# EAGLE schematic Main_board (EAGLE 6.5.0)

## Sheet 1 of 2
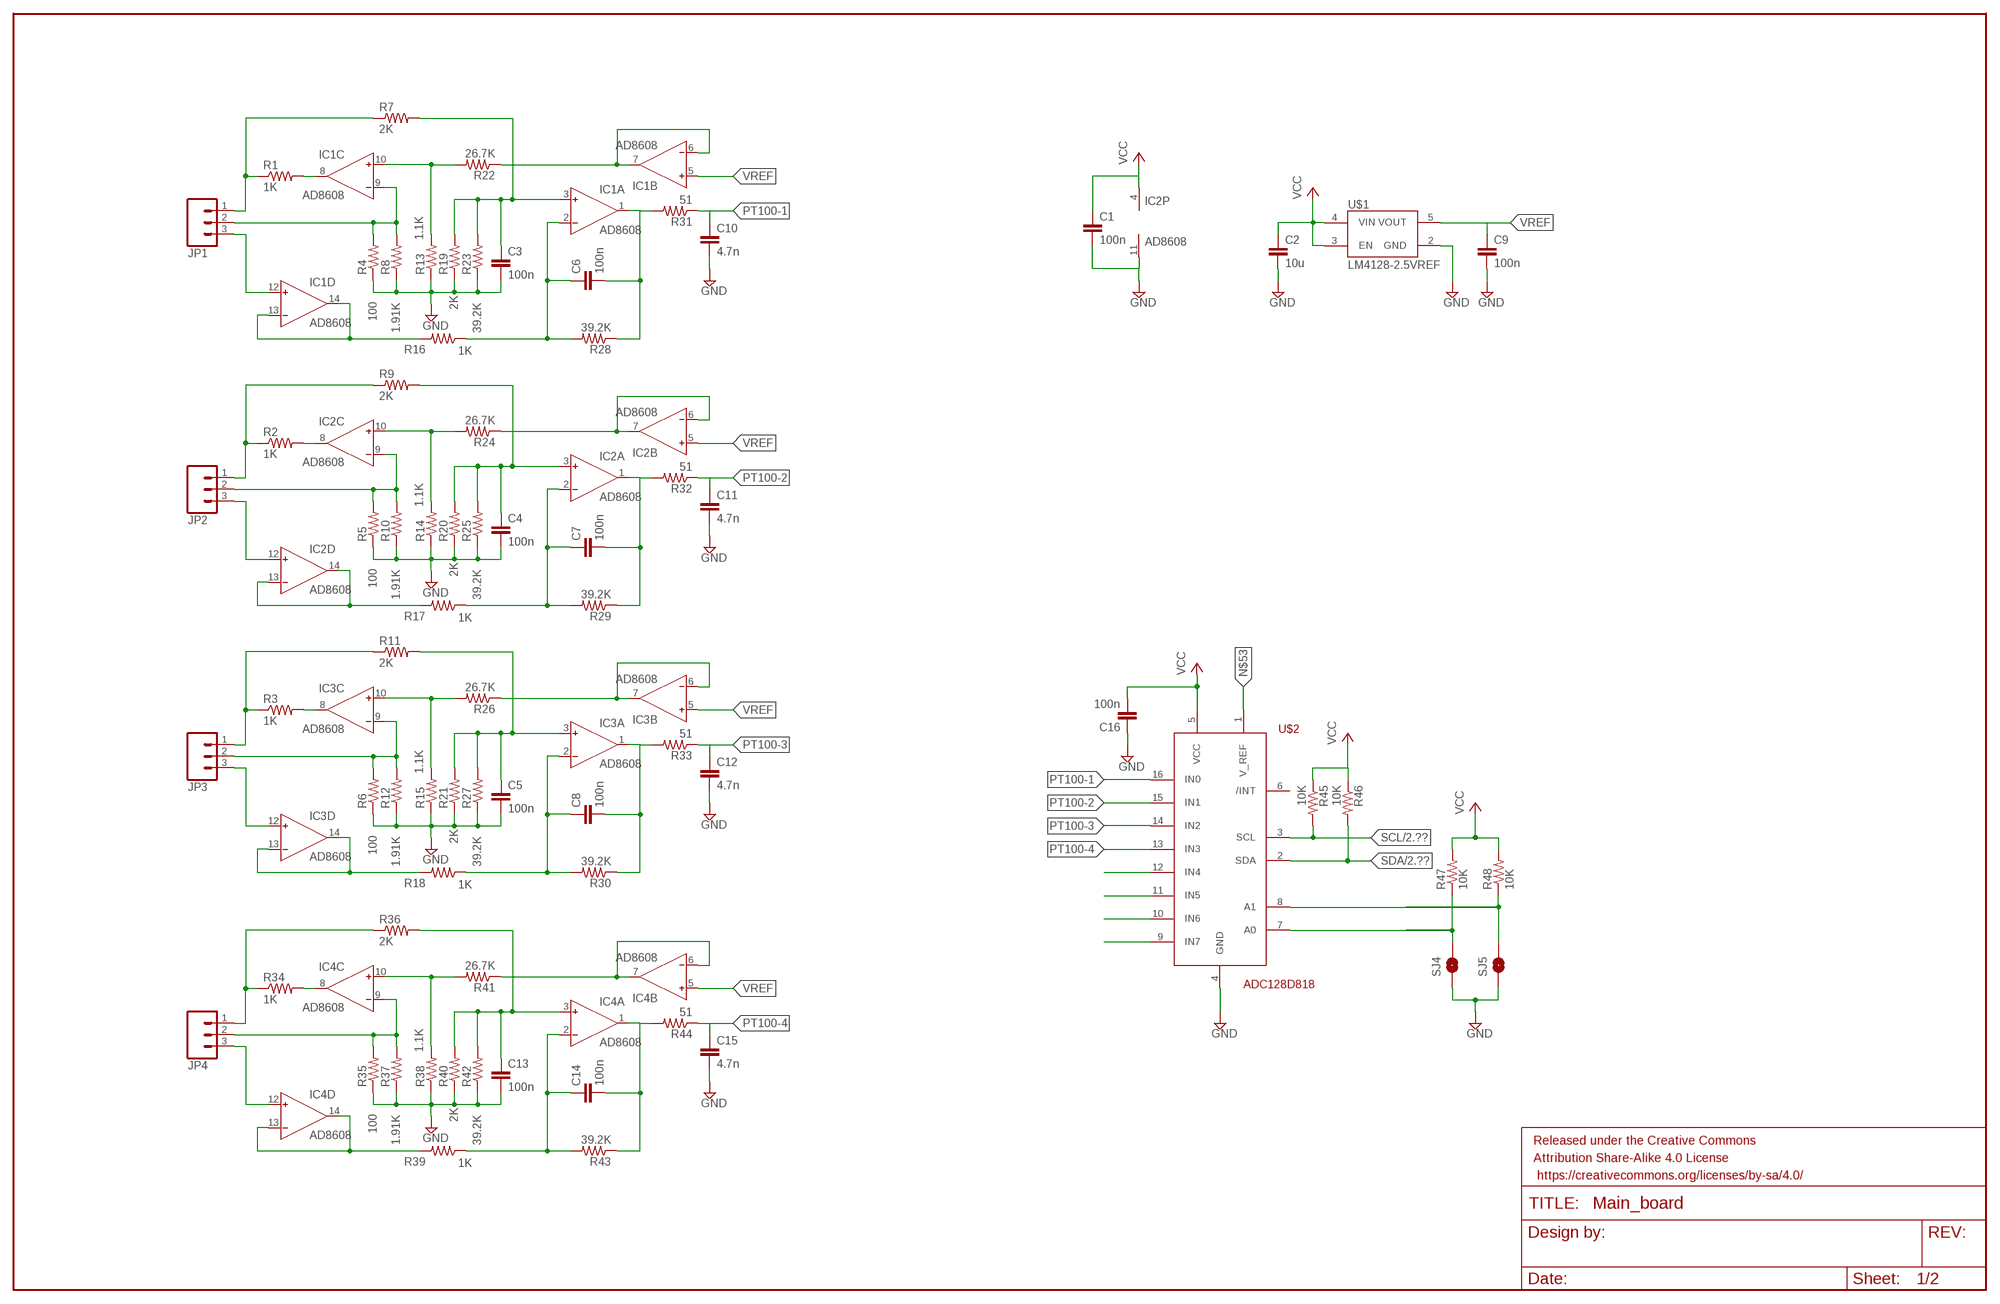
[diagram p0: schematic, sheet 1]

### Parts
C1  100n  CAP0805  [0805]
C2  10u  CAP0805  [0805]
C3  100n  CAP0805  [0805]
C4  100n  CAP0805  [0805]
C5  100n  CAP0805  [0805]
C6  100n  CAP0805  [0805]
C7  100n  CAP0805  [0805]
C8  100n  CAP0805  [0805]
C9  100n  CAP0805  [0805]
C10  4.7n  CAP0805  [0805]
C11  4.7n  CAP0805  [0805]
C12  4.7n  CAP0805  [0805]
C13  100n  CAP0805  [0805]
C14  100n  CAP0805  [0805]
C15  4.7n  CAP0805  [0805]
C16  100n  CAP0805  [0805]
FRAME1  FRAME-LEDGER  [CREATIVE_COMMONS]
IC1  AD8608  AD8609R  [SO14]
IC2  AD8608  AD8609R  [SO14]
IC3  AD8608  AD8609R  [SO14]
IC4  AD8608  AD8609R  [SO14]
JP1  M03SCREW  [SCREWTERMINAL-3.5MM-3]
JP2  M03SCREW  [SCREWTERMINAL-3.5MM-3]
JP3  M03SCREW  [SCREWTERMINAL-3.5MM-3]
JP4  M03SCREW  [SCREWTERMINAL-3.5MM-3]
R1  1K  RESISTOR0805-RES  [0805]
R2  1K  RESISTOR0805-RES  [0805]
R3  1K  RESISTOR0805-RES  [0805]
R4  100  RESISTOR0805-RES  [0805]
R5  100  RESISTOR0805-RES  [0805]
R6  100  RESISTOR0805-RES  [0805]
R7  2K  RESISTOR0805-RES  [0805]
R8  1.91K  RESISTOR0805-RES  [0805]
R9  2K  RESISTOR0805-RES  [0805]
R10  1.91K  RESISTOR0805-RES  [0805]
R11  2K  RESISTOR0805-RES  [0805]
R12  1.91K  RESISTOR0805-RES  [0805]
R13  1.1K  RESISTOR0805-RES  [0805]
R14  1.1K  RESISTOR0805-RES  [0805]
R15  1.1K  RESISTOR0805-RES  [0805]
R16  1K  RESISTOR0805-RES  [0805]
R17  1K  RESISTOR0805-RES  [0805]
R18  1K  RESISTOR0805-RES  [0805]
R19  2K  RESISTOR0805-RES  [0805]
R20  2K  RESISTOR0805-RES  [0805]
R21  2K  RESISTOR0805-RES  [0805]
R22  26.7K  RESISTOR0805-RES  [0805]
R23  39.2K  RESISTOR0805-RES  [0805]
R24  26.7K  RESISTOR0805-RES  [0805]
R25  39.2K  RESISTOR0805-RES  [0805]
R26  26.7K  RESISTOR0805-RES  [0805]
R27  39.2K  RESISTOR0805-RES  [0805]
R28  39.2K  RESISTOR0805-RES  [0805]
R29  39.2K  RESISTOR0805-RES  [0805]
R30  39.2K  RESISTOR0805-RES  [0805]
R31  51  RESISTOR0805-RES  [0805]
R32  51  RESISTOR0805-RES  [0805]
R33  51  RESISTOR0805-RES  [0805]
R34  1K  RESISTOR0805-RES  [0805]
R35  100  RESISTOR0805-RES  [0805]
R36  2K  RESISTOR0805-RES  [0805]
R37  1.91K  RESISTOR0805-RES  [0805]
R38  1.1K  RESISTOR0805-RES  [0805]
R39  1K  RESISTOR0805-RES  [0805]
R40  2K  RESISTOR0805-RES  [0805]
R41  26.7K  RESISTOR0805-RES  [0805]
R42  39.2K  RESISTOR0805-RES  [0805]
R43  39.2K  RESISTOR0805-RES  [0805]
R44  51  RESISTOR0805-RES  [0805]
R45  10K  RESISTOR0805-RES  [0805]
R46  10K  RESISTOR0805-RES  [0805]
R47  10K  RESISTOR0805-RES  [0805]
R48  10K  RESISTOR0805-RES  [0805]
SJ4  SOLDERJUMPERNC  [SJ_2S]
SJ5  SOLDERJUMPERNC  [SJ_2S]
U$1  LM4128-2.5VREF  [SOT23-5]
U$2  ADC128D818  [SSOP16]

### Nets
GND: C1.2 C2.2 C3.2 C4.2 C5.2 C9.2 C10.2 C11.2 C12.2 C13.2 C15.2 C16.1 IC2.11(P:V-) R4.1 R5.1 R6.1 R8.1 R10.1 R12.1 R13.1 R14.1 R15.1 R19.1 R20.1 R21.1 R23.1 R25.1 R27.1 R35.1 R37.1 R38.1 R40.1 R42.1 SJ4.1 SJ5.1 U$1.2(GND) U$2.4(GND) ; also sheet 2
N$1: IC2.12(D:IN+) JP2.3
N$2: IC2.13(D:IN-) IC2.14(D:OUT) R17.2
N$3: IC2.9(C:IN-) JP2.2 R5.2 R10.2
N$4: JP2.1 R2.1 R9.1
N$5: IC2.8(C:OUT) R2.2
N$6: IC3.12(D:IN+) JP3.3
N$7: IC3.13(D:IN-) IC3.14(D:OUT) R18.2
N$8: IC2.10(C:IN+) R14.2 R24.2
N$9: C4.1 IC2.3(A:IN+) R9.2 R20.2 R25.2
N$10: IC2.6(B:IN-) IC2.7(B:OUT) R24.1
N$11: IC3.9(C:IN-) JP3.2 R6.2 R12.2
N$12: JP3.1 R3.1 R11.1
N$13: C7.1 IC2.2(A:IN-) R17.1 R29.2
N$14: C7.2 IC2.1(A:OUT) R29.1 R32.2
N$15: IC3.8(C:OUT) R3.2
N$16: IC3.10(C:IN+) R15.2 R26.2
N$17: C5.1 IC3.3(A:IN+) R11.2 R21.2 R27.2
N$18: IC3.6(B:IN-) IC3.7(B:OUT) R26.1
N$19: C8.1 IC3.2(A:IN-) R18.1 R30.2
N$20: C8.2 IC3.1(A:OUT) R30.1 R33.2
N$21: IC4.12(D:IN+) JP4.3
N$22: IC4.13(D:IN-) IC4.14(D:OUT) R39.2
N$23: IC4.9(C:IN-) JP4.2 R35.2 R37.2
N$24: JP4.1 R34.1 R36.1
N$25: IC4.8(C:OUT) R34.2
N$26: IC4.10(C:IN+) R38.2 R41.2
N$27: C13.1 IC4.3(A:IN+) R36.2 R40.2 R42.2
N$28: IC4.6(B:IN-) IC4.7(B:OUT) R41.1
N$29: C14.1 IC4.2(A:IN-) R39.1 R43.2
N$30: C14.2 IC4.1(A:OUT) R43.1 R44.2
N$31: IC1.12(D:IN+) JP1.3
N$32: IC1.13(D:IN-) IC1.14(D:OUT) R16.2
N$33: IC1.9(C:IN-) JP1.2 R4.2 R8.2
N$34: JP1.1 R1.1 R7.1
N$35: IC1.8(C:OUT) R1.2
N$36: IC1.10(C:IN+) R13.2 R22.2
N$37: C3.1 IC1.3(A:IN+) R7.2 R19.2 R23.2
N$38: IC1.6(B:IN-) IC1.7(B:OUT) R22.1
N$39: C6.1 IC1.2(A:IN-) R16.1 R28.2
N$40: C6.2 IC1.1(A:OUT) R28.1 R31.2
N$45: U$2.12(IN4)
N$46: U$2.11(IN5)
N$47: U$2.10(IN6)
N$48: U$2.9(IN7)
N$51: R48.1 SJ5.2 U$2.8(A1)
N$52: R47.1 SJ4.2 U$2.7(A0)
N$53: U$2.1(V_REF)
PT100-1: C10.1 R31.1 U$2.16(IN0)
PT100-2: C11.1 R32.1 U$2.15(IN1)
PT100-3: C12.1 R33.1 U$2.14(IN2)
PT100-4: C15.1 R44.1 U$2.13(IN3)
SCL: R45.2 U$2.3(SCL) ; also sheet 2
SDA: R46.2 U$2.2(SDA) ; also sheet 2
VCC: C1.1 C2.1 C16.2 IC2.4(P:V+) R45.1 R46.1 R47.2 R48.2 U$1.3(EN) U$1.4(VIN) U$2.5(VCC) ; also sheet 2
VREF: C9.1 IC1.5(B:IN+) IC2.5(B:IN+) IC3.5(B:IN+) IC4.5(B:IN+) U$1.5(VOUT)
Unconnected: U$2.6(/INT)

## Sheet 2 of 2
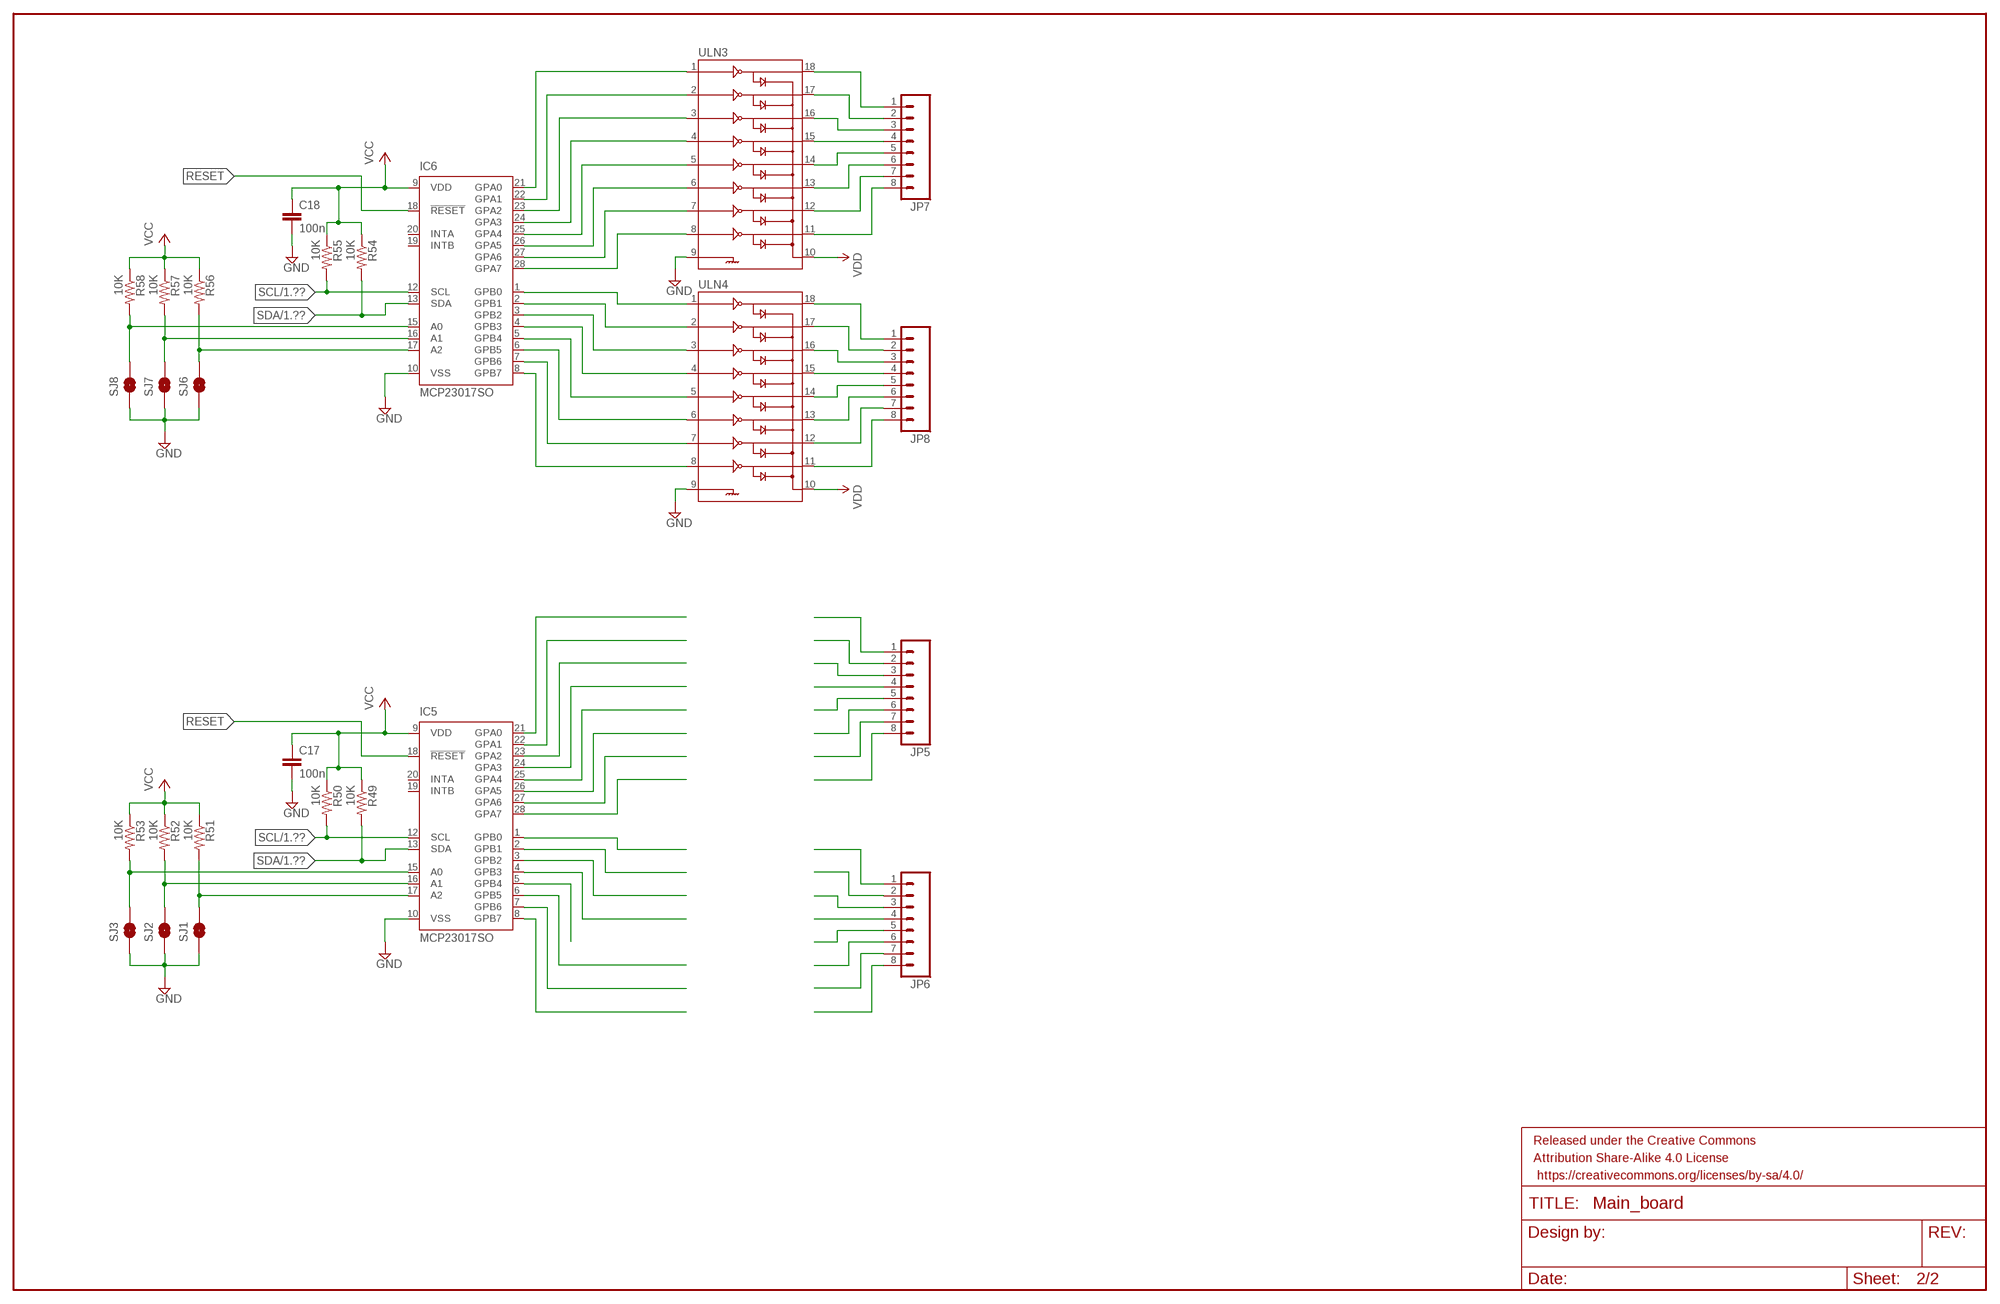
[diagram p1: schematic, sheet 2]

### Parts
C17  100n  CAP0805  [0805]
C18  100n  CAP0805  [0805]
FRAME2  FRAME-LEDGER  [CREATIVE_COMMONS]
IC5  MCP23017SO  [SO28W]
IC6  MCP23017SO  [SO28W]
JP5  M083.5MM-8  [SCREWTERMINAL-3.5MM-8]
JP6  M083.5MM-8  [SCREWTERMINAL-3.5MM-8]
JP7  M083.5MM-8  [SCREWTERMINAL-3.5MM-8]
JP8  M083.5MM-8  [SCREWTERMINAL-3.5MM-8]
R49  10K  RESISTOR0805-RES  [0805]
R50  10K  RESISTOR0805-RES  [0805]
R51  10K  RESISTOR0805-RES  [0805]
R52  10K  RESISTOR0805-RES  [0805]
R53  10K  RESISTOR0805-RES  [0805]
R54  10K  RESISTOR0805-RES  [0805]
R55  10K  RESISTOR0805-RES  [0805]
R56  10K  RESISTOR0805-RES  [0805]
R57  10K  RESISTOR0805-RES  [0805]
R58  10K  RESISTOR0805-RES  [0805]
SJ1  SOLDERJUMPERNC  [SJ_2S]
SJ2  SOLDERJUMPERNC  [SJ_2S]
SJ3  SOLDERJUMPERNC  [SJ_2S]
SJ6  SOLDERJUMPERNC  [SJ_2S]
SJ7  SOLDERJUMPERNC  [SJ_2S]
SJ8  SOLDERJUMPERNC  [SJ_2S]
ULN3  ULN2803SOIC  [SO018]
ULN4  ULN2803SOIC  [SO018]

### Nets
GND: C17.2 C18.2 IC5.10(VSS) IC6.10(VSS) SJ1.1 SJ2.1 SJ3.1 SJ6.1 SJ7.1 SJ8.1 ULN3.9 ULN4.9 ; also sheet 1
N$41: IC5.28(GPA7)
N$42: IC5.27(GPA6)
N$43: IC5.26(GPA5)
N$44: IC5.25(GPA4)
N$49: IC5.24(GPA3)
N$50: IC5.23(GPA2)
N$54: IC5.21(GPA0)
N$55: IC5.22(GPA1)
N$56: IC5.1(GPB0)
N$57: IC5.2(GPB1)
N$58: IC5.3(GPB2)
N$59: IC5.4(GPB3)
N$60: IC5.5(GPB4)
N$61: IC5.6(GPB5)
N$62: IC5.7(GPB6)
N$63: IC5.8(GPB7)
N$64: JP6.1
N$65: JP6.2
N$66: JP6.3
N$67: JP6.4
N$68: JP6.5
N$69: JP6.6
N$70: JP6.7
N$71: JP6.8
N$72: JP5.1
N$73: JP5.2
N$74: JP5.3
N$75: JP5.4
N$76: JP5.5
N$77: JP5.6
N$78: JP5.7
N$79: JP5.8
N$80: IC6.28(GPA7) ULN3.8
N$81: IC6.27(GPA6) ULN3.7
N$82: IC5.17(A2) R51.2 SJ1.2
N$83: IC5.16(A1) R52.2 SJ2.2
N$84: IC5.15(A0) R53.2 SJ3.2
N$85: IC6.26(GPA5) ULN3.6
N$86: IC6.25(GPA4) ULN3.5
N$87: IC6.24(GPA3) ULN3.4
N$88: IC6.23(GPA2) ULN3.3
N$89: IC6.21(GPA0) ULN3.1
N$90: IC6.22(GPA1) ULN3.2
N$91: IC6.1(GPB0) ULN4.1
N$92: IC6.2(GPB1) ULN4.2
N$93: IC6.3(GPB2) ULN4.3
N$94: IC6.4(GPB3) ULN4.4
N$95: IC6.5(GPB4) ULN4.5
N$96: IC6.6(GPB5) ULN4.6
N$97: IC6.7(GPB6) ULN4.7
N$98: IC6.8(GPB7) ULN4.8
N$99: JP8.1 ULN4.18
N$100: JP8.2 ULN4.17
N$101: JP8.3 ULN4.16
N$102: JP8.4 ULN4.15
N$103: JP8.5 ULN4.14
N$104: JP8.6 ULN4.13
N$105: JP8.7 ULN4.12
N$106: JP8.8 ULN4.11
N$107: JP7.1 ULN3.18
N$108: JP7.2 ULN3.17
N$109: JP7.3 ULN3.16
N$110: JP7.4 ULN3.15
N$111: JP7.5 ULN3.14
N$112: JP7.6 ULN3.13
N$113: JP7.7 ULN3.12
N$114: JP7.8 ULN3.11
N$115: IC6.17(A2) R56.2 SJ6.2
N$116: IC6.16(A1) R57.2 SJ7.2
N$117: IC6.15(A0) R58.2 SJ8.2
RESET: IC5.18(!RESET) IC6.18(!RESET)
SCL: IC5.12(SCL) IC6.12(SCL) R50.2 R55.2 ; also sheet 1
SDA: IC5.13(SDA) IC6.13(SDA) R49.2 R54.2 ; also sheet 1
VCC: C17.1 C18.1 IC5.9(VDD) IC6.9(VDD) R49.1 R50.1 R51.1 R52.1 R53.1 R54.1 R55.1 R56.1 R57.1 R58.1 ; also sheet 1
VDD: ULN3.10 ULN4.10
Unconnected: IC5.19(INTB) IC5.20(INTA) IC6.19(INTB) IC6.20(INTA)

## Power pins joined to a net without a drawn wire
V+: IC1.4(P:V+) IC3.4(P:V+) IC4.4(P:V+)
V-: IC1.11(P:V-) IC3.11(P:V-) IC4.11(P:V-)

## Library data of the parts
C1-C18 = SparkFun-Capacitors:CAP: Capacitor Standard 0603 ceramic capacitor, and 0.1" leaded capacitor.
FRAME1 FRAME2 = SparkFun-Aesthetics:FRAME-LEDGER: Schematic Frame Standard 11x14 US Ledger frame
IC1-IC4 = analog-devices:AD8609: Precision Micropower, Low Noise CMOS, Rail-to-Rail Input/Output Operational Amplifiers Source: http://www.analog.com/static/imported-files/data_sheets/AD8603_8607_8609.pdf; MPN: AD8609ARZ; OC_FARNELL: 1581951; OC_NEWARK: 19M0976
IC5 IC6 = microchip:MCP23017: http://ww1.microchip.com/downloads/en/DeviceDoc/21952a.pdf Source: http://ww1.microchip.com/downloads/en/DeviceDoc/21952a.pdf; MF: MICROCHIP; MPN: MCP23017-E/SO; OC_FARNELL: 1332087; OC_NEWARK: 31K2958
JP1-JP4 = SparkFun-Connectors:M03: Header 3 Standard 3-pin 0.1" header. Use with straight break away headers (SKU : PRT-00116), right angle break away headers (PRT-00553), swiss pins (PRT-00743), machine pins (PRT-00117), and female headers (PRT-00115). Molex polarized connector foot print use with SKU : PRT-08232 with associated crimp pins and housings.
JP5-JP8 = SparkFun-Connectors:M08: Header 8 Standard 8-pin 0.1" header. Use with straight break away headers (SKU : PRT-00116), right angle break away headers (PRT-00553), swiss pins (PRT-00743), machine pins (PRT-00117), and female headers (PRT-00115).
R1-R58 = SparkFun-Passives:RESISTOR: Resistor Basic schematic elements and footprints for 0603, 1206, and PTH resistors.
SJ1-SJ8 = SparkFun-Retired:SOLDERJUMPER: Solder Jumper Standard SMD solder jumper. Used to automate production. Two varients : Normally Open and Normally Closed are the same, but have different paste layers. NC will have a large amount of paste and should jumper during reflow.
U$1 = SparkFun-PowerIC:LM4128-2.5VREF: .1% accurate low-current voltage reference
U$2 = linear:ADC128D818
ULN3 ULN4 = SparkFun-PowerIC:ULN2803: Darlington Driver ULN2803 Darlington array. 500mA max per channel, 8-channel package. Spark Fun Electronics SKU : COM-00312